# EAGLE schematic ArduinoProMicroKame (EAGLE 7.2.0)
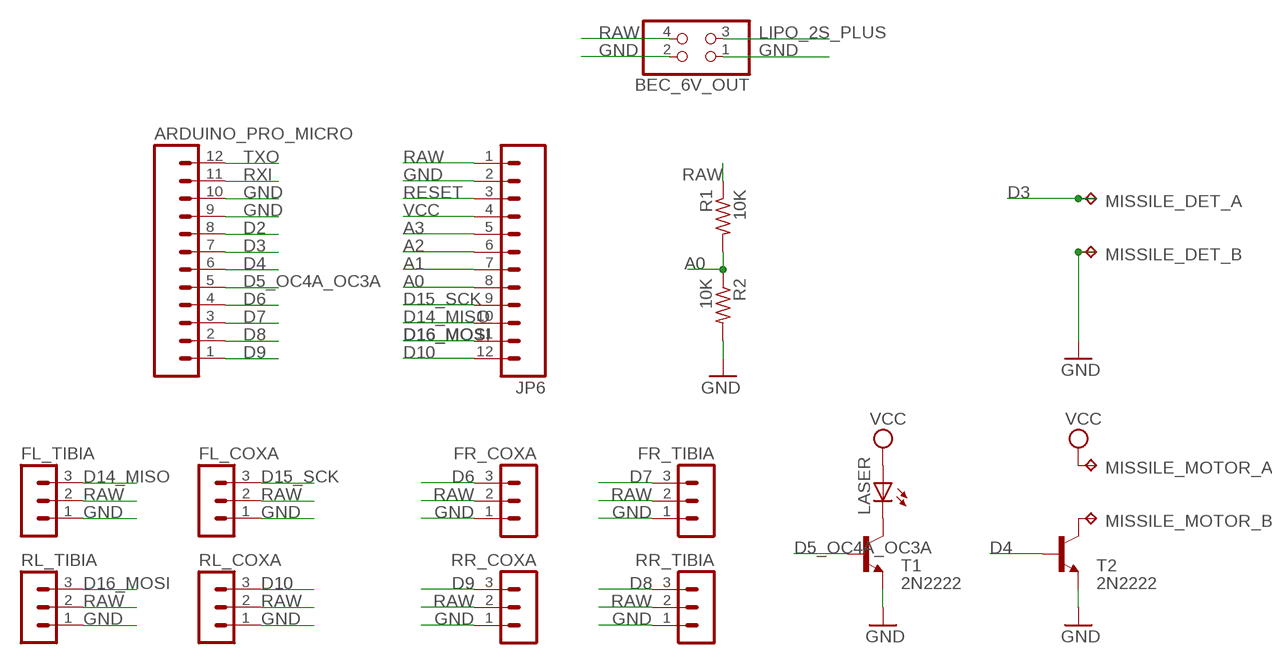
[diagram p0: schematic, sheet 1]

## Parts
ARDUINO_PRO_MICRO  M12PTH  [1X12]
BEC_6V_OUT  PINHD-2X2  [2X02]
FL_COXA  MA03-1  [MA03-1]
FL_TIBIA  MA03-1  [MA03-1]
FR_COXA  MA03-1  [MA03-1]
FR_TIBIA  MA03-1  [MA03-1]
JP6  M12PTH  [1X12]
LASER  LED  [SMARTLED-TTW]
MISSILE_DET_  TP2P2-38-20  [P2-38-20]
MISSILE_MOTOR_  TP2P2-38-20  [P2-38-20]
R1  10K  R-US_R2010  [R2010]
R2  10K  R-US_R2010  [R2010]
RL_COXA  MA03-1  [MA03-1]
RL_TIBIA  MA03-1  [MA03-1]
RR_COXA  MA03-1  [MA03-1]
RR_TIBIA  MA03-1  [MA03-1]
T1  2N2222  [TO18]
T2  2N2222  [TO18]

## Nets
A0: JP6.8 R1.2 R2.1
A1: JP6.7
A2: JP6.6
A3: JP6.5
D2: ARDUINO_PRO_MICRO.8
D3: ARDUINO_PRO_MICRO.7 MISSILE_DET_.TP-1
D4: ARDUINO_PRO_MICRO.6 T2.2(B)
D5_OC4A_OC3A: ARDUINO_PRO_MICRO.5 T1.2(B)
D6: ARDUINO_PRO_MICRO.4 FR_COXA.3
D7: ARDUINO_PRO_MICRO.3 FR_TIBIA.3
D8: ARDUINO_PRO_MICRO.2 RR_TIBIA.3
D9: ARDUINO_PRO_MICRO.1 RR_COXA.3
D10: JP6.12 RL_COXA.3
D14_MISO: FL_TIBIA.3 JP6.10
D15_SCK: FL_COXA.3 JP6.9
D16_MOSI: JP6.11 RL_TIBIA.3
GND [vcc]: ARDUINO_PRO_MICRO.9 ARDUINO_PRO_MICRO.10 BEC_6V_OUT.1 BEC_6V_OUT.2 FL_COXA.1 FL_TIBIA.1 FR_COXA.1 FR_TIBIA.1 JP6.2 MISSILE_DET_.TP-2 R2.2 RL_COXA.1 RL_TIBIA.1 RR_COXA.1 RR_TIBIA.1 T1.1(E) T2.1(E)
LIPO_2S_PLUS: BEC_6V_OUT.3
N$1: LASER.C@1(C) T1.3(C)
N$2: MISSILE_MOTOR_.TP-2 T2.3(C)
RAW [vcc]: BEC_6V_OUT.4 FL_COXA.2 FL_TIBIA.2 FR_COXA.2 FR_TIBIA.2 JP6.1 R1.1 RL_COXA.2 RL_TIBIA.2 RR_COXA.2 RR_TIBIA.2
RESET: JP6.3
RXI: ARDUINO_PRO_MICRO.11
TXO: ARDUINO_PRO_MICRO.12
VCC: JP6.4 LASER.A@1(A) MISSILE_MOTOR_.TP-1

## Library data of the parts
ARDUINO_PRO_MICRO JP6 = SparkFun:M12: Header 12 Standard 12-pin 0.1" header. Use with straight break away headers (SKU : PRT-00116), right angle break away headers (PRT-00553), swiss pins (PRT-00743), machine pins (PRT-00117), and female headers (PRT-00115).
BEC_6V_OUT = pinhead:PINHD-2X2: PIN HEADER
FL_COXA FL_TIBIA FR_COXA FR_TIBIA RL_COXA RL_TIBIA RR_COXA RR_TIBIA = con-lstb:MA03-1: PIN HEADER; OC_FARNELL: unknown; OC_NEWARK: unknown
LASER = led:LED: LED OSRAM: - CHIPLED LG R971, LG N971, LY N971, LG Q971, LY Q971, LO R971, LY R971 LH N974, LH R974 LS Q976, LO Q976, LY Q976 LO Q996 - Hyper CHIPLED LW Q18S LB Q993, LB Q99A, LB R99A - SideLED LS A670, LO A670, LY A670, LG A670, LP A670 LB A673, LV A673, LT A673, LW A673 LH A674 LY A675 LS A676, LA A676, LO A676, LY A676, LW A676 LS A679, LY A679, LG A679 - Hyper Micro SIDELED® LS Y876, LA Y876, LO Y876, LY Y876 LT Y87S - SmartLED LW L88C, LW L88S LB L89C, LB L89S, LG L890 LS L89K, LO L89K, LY L89K LS L896, LA L896, LO L896, LY L896 - TOPLED LS T670, LO T670, LY T670, LG T670, LP T670 LSG T670, LSP T670, LSY T670, LOP T670, LYG T670 LG T671, LOG T671, LSG T671 LB T673, LV T673, LT T673, LW T673 LH T674 LS T676, LA T676, LO T676, LY T676, LB T676, LH T676, LSB T676, LW T676 LB T67C, LV T67C, LT T67C, LS T67K, LO T67K, LY T67K, LW E67C LS E67B, LA E67B, LO E67B, LY E67B, LB E67C, LV E67C, LT E67C LW T67C LS T679, LY T679, LG T679 LS T770, LO T770, LY T770, LG T770, LP T770 LB T773, LV T773, LT T773, LW T773 LH T774 LS E675, LA E675, LY E675, LS T675 LS T776, LA T776, LO T776, LY T776, LB T776 LHGB T686 LT T68C, LB T68C - Hyper Mini TOPLED® LB M676 - Mini TOPLED Santana® LG M470 LS M47K, LO M47K, LY M47K Source: http://www.osram.convergy.de LUXEON: - LUMILED® LXK2-PW12-R00, LXK2-PW12-S00, LXK2-PW14-U00, LXK2-PW14-V00 LXK2-PM12-R00, LXK2-PM12-S00, LXK2-PM14-U00 LXK2-PE12-Q00, LXK2-PE12-R00, LXK2-PE12-S00, LXK2-PE14-T00, LXK2-PE14-U00 LXK2-PB12-K00, LXK2-PB12-L00, LXK2-PB12-M00, LXK2-PB14-N00, LXK2-PB14-P00, LXK2-PB14-Q00 LXK2-PR12-L00, LXK2-PR12-M00, LXK2-PR14-Q00, LXK2-PR14-R00 LXK2-PD12-Q00, LXK2-PD12-R00, LXK2-PD12-S00 LXK2-PH12-R00, LXK2-PH12-S00 LXK2-PL12-P00, LXK2-PL12-Q00, LXK2-PL12-R00 Source: www.luxeon.com KINGBRIGHT: KA-3528ASYC Source: www.kingbright.com
MISSILE_DET_ MISSILE_MOTOR_ = testpad:TP2: Test pad
R1 R2 = resistor:R-US_: RESISTOR, American symbol
T1 T2 = transistor:2N2222: NPN TRANSISTOR

## Net classes
0 default: width 0.203 mm